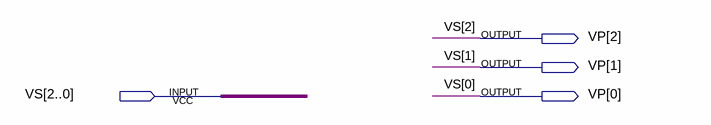
[diagram p0: schematic sheet]
// Quartus schematic Valor_Serial_Paralelo.bdf as structural Verilog: 0 symbols, 4 pins
module Valor_Serial_Paralelo (
  input  [2:0] VS,
  output [2:0] VP
);


  assign VP = VS;
endmodule
